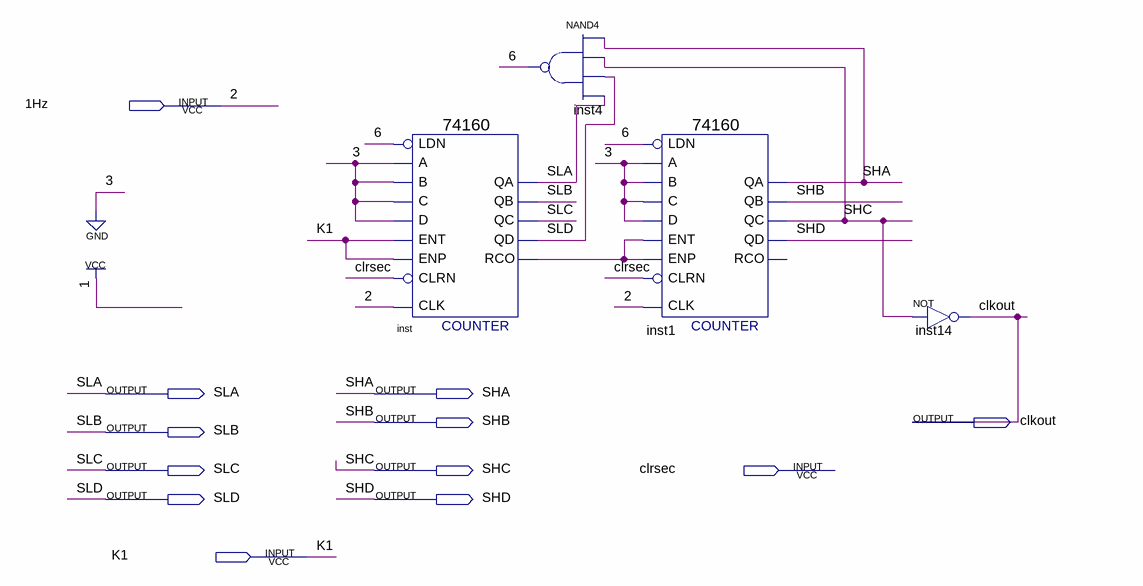
[diagram p0: schematic sheet]
// Quartus schematic SECOND.bdf as structural Verilog: 4 symbols, 12 pins
module SECOND (
  input  \1Hz ,
  input  clrsec,
  input  K1,
  output SLA,
  output SHA,
  output SHB,
  output clkout,
  output SLB,
  output SLC,
  output SHC,
  output SLD,
  output SHD
);

  wire \6 , inst_rco;

  \74160  inst (
    .CLK(\1Hz ), .ENT(K1), .A(1'b0), .B(1'b0), .C(1'b0), .D(1'b0), .LDN(\6 ), .ENP(K1), .CLRN(clrsec),
    .QD(SLD), .QA(SLA), .QB(SLB), .QC(SLC), .RCO(inst_rco));
  nand inst4 (\6 , SHA, SHC, SLD, SLA);
  \74160  inst1 (
    .CLK(\1Hz ), .ENT(inst_rco), .A(1'b0), .B(1'b0), .C(1'b0), .D(1'b0), .LDN(\6 ), .ENP(inst_rco),
    .CLRN(clrsec), .QD(SHD), .QA(SHA), .QB(SHB), .QC(SHC));  // open: RCO
  not inst14 (clkout, SHC);

  // Other names for the same wires on the sheet: 2 = \1Hz 
endmodule
